# EAGLE design safebox_professional (EAGLE 9.6.2)
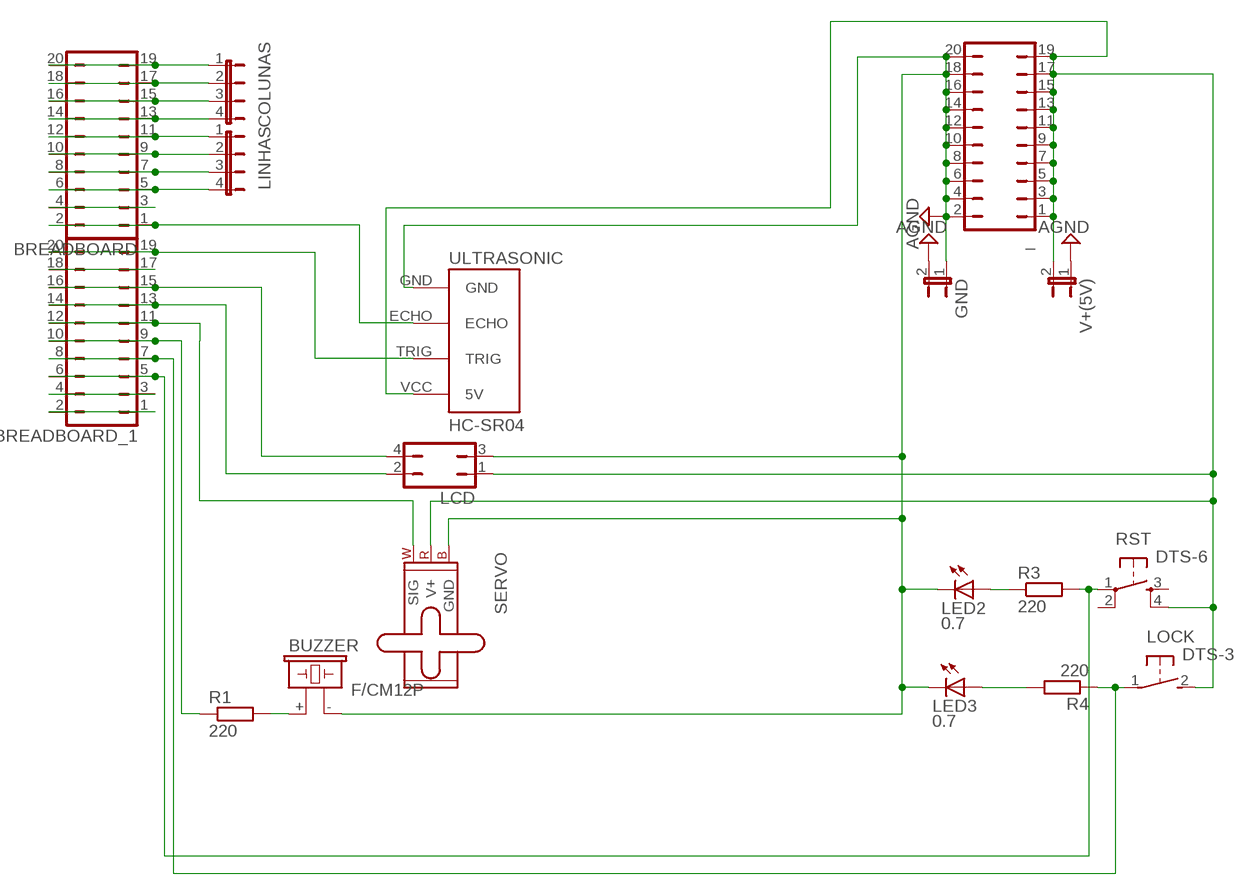
[diagram p0: schematic, sheet 1]

## Parts
_  JP10Q  [JP10Q]
BREADBOARD  JP10Q  [JP10Q]
BREADBOARD_1  JP10Q  [JP10Q]
BUZZER  F/CM12P  [F/CM12P]
COLUNAS  JP4E  [JP4]
GND  JP1E  [JP1]
LCD  JP2Q  [JP2Q]
LED2  0.7  LED5MM  [LED5MM]
LED3  0.7  LED5MM  [LED5MM]
LINHAS  JP4E  [JP4]
LOCK  DTS-3  [DTS-3]
M2  SERVO  [1X03]
R1  220  R-EU_0207/12  [0207/12]
R3  220  R-EU_0207/12  [0207/12]
R4  220  R-EU_0207/12  [0207/12]
RST  DTS-6  [DTS-6]
ULTRASONIC  HC-SR04  [HC-SR04_FOOTPRINT]
V+(5V)  JP1E  [JP1]

## Nets
AGND: _.2 _.4 _.6 _.8 _.10 _.12 _.14 _.16 _.18 _.20 BUZZER.- GND.1 GND.2 LCD.3 LED2.K(C) LED3.K(C) M2.3(GND) ULTRASONIC.GND V+(5V).1
N$1: BREADBOARD_1.5 BREADBOARD_1.6 R3.2 RST.1
N$2: BREADBOARD_1.1 BREADBOARD_1.2
N$3: BREADBOARD.19 BREADBOARD.20 COLUNAS.1
N$4: BREADBOARD.17 BREADBOARD.18 COLUNAS.2
N$5: BREADBOARD.15 BREADBOARD.16 COLUNAS.3
N$6: BREADBOARD.13 BREADBOARD.14 COLUNAS.4
N$7: BREADBOARD.11 BREADBOARD.12 LINHAS.1
N$8: BREADBOARD.9 BREADBOARD.10 LINHAS.2
N$9: BREADBOARD.7 BREADBOARD.8 LINHAS.3
N$10: BREADBOARD.5 BREADBOARD.6 LINHAS.4
N$11: LED2.A R3.1
N$12: BUZZER.+ R1.2
N$13: BREADBOARD.1 BREADBOARD.2 ULTRASONIC.ECHO
N$14: BREADBOARD_1.15 BREADBOARD_1.16 LCD.4
N$15: BREADBOARD_1.13 BREADBOARD_1.14 LCD.2
N$16: BREADBOARD_1.17 BREADBOARD_1.18
N$17: BREADBOARD_1.9 BREADBOARD_1.10 R1.1
N$18: BREADBOARD_1.7 BREADBOARD_1.8 LOCK.1 R4.1
N$19: BREADBOARD_1.11 BREADBOARD_1.12 M2.1(SIG)
N$20: BREADBOARD.3 BREADBOARD.4
N$21: BREADBOARD_1.19 BREADBOARD_1.20 ULTRASONIC.TRIG
N$23: BREADBOARD_1.3 BREADBOARD_1.4
N$24: LED3.A R4.2
N$26: _.1 _.3 _.5 _.7 _.9 _.11 _.13 _.15 _.17 _.19 LCD.1 LOCK.2 M2.2(V+) RST.4 ULTRASONIC.VCC(5V) V+(5V).2
Unconnected: RST.2 RST.3

## Library data of the parts
_ BREADBOARD BREADBOARD_1 = jumper:JP10Q: JUMPER
BUZZER = buzzer:F/CM12P: BUZZER Source: Buerklin; OC_FARNELL: unknown; OC_NEWARK: unknown
COLUNAS LINHAS = jumper:JP4E: JUMPER
GND V+(5V) = jumper:JP1E: JUMPER
LCD = jumper:JP2Q: JUMPER
LED2 LED3 = adafruit:LED: LED OSRAM: - CHIPLED LG R971, LG N971, LY N971, LG Q971, LY Q971, LO R971, LY R971 LH N974, LH R974 LS Q976, LO Q976, LY Q976 LO Q996 - Hyper CHIPLED LW Q18S LB Q993, LB Q99A, LB R99A - SideLED LS A670, LO A670, LY A670, LG A670, LP A670 LB A673, LV A673, LT A673, LW A673 LH A674 LY A675 LS A676, LA A676, LO A676, LY A676, LW A676 LS A679, LY A679, LG A679 - Hyper Micro SIDELED® LS Y876, LA Y876, LO Y876, LY Y876 LT Y87S - SmartLED LW L88C, LW L88S LB L89C, LB L89S, LG L890 LS L89K, LO L89K, LY L89K LS L896, LA L896, LO L896, LY L896 - TOPLED LS T670, LO T670, LY T670, LG T670, LP T670 LSG T670, LSP T670, LSY T670, LOP T670, LYG T670 LG T671, LOG T671, LSG T671 LB T673, LV T673, LT T673, LW T673 LH T674 LS T676, LA T676, LO T676, LY T676, LB T676, LH T676, LSB T676, LW T676 LB T67C, LV T67C, LT T67C, LS T67K, LO T67K, LY T67K, LW E67C LS E67B, LA E67B, LO E67B, LY E67B, LB E67C, LV E67C, LT E67C LW T67C LS T679, LY T679, LG T679 LS T770, LO T770, LY T770, LG T770, LP T770 LB T773, LV T773, LT T773, LW T773 LH T774 LS E675, LA E675, LY E675, LS T675 LS T776, LA T776, LO T776, LY T776, LB T776 LHGB T686 LT T68C, LB T68C - Hyper Mini TOPLED® LB M676 - Mini TOPLED Santana® LG M470 LS M47K, LO M47K, LY M47K Source: http://www.osram.convergy.de/
LOCK = switch-tact:DTS-3
M2 = SparkFun-Electromechanical:SERVO: Servo Motor 3-pin connector for a standard servo motor (voltage supply, ground, and control signal.) SparkFun Products Servo - Generic (Sub-Micro Size) <https://www.sparkfun.com/products/9065> (ROB-09065) Servo - Generic High Torque Continuous Rotation (Standard Size) <https://www.sparkfun.com/products/9347> (ROB-09347) Servo - Generic High Torque (Standard Size) <https://www.sparkfun.com/products/11965> (ROB-11965)
R1 R3 R4 = rcl:R-EU_: RESISTOR, European symbol; SPICEPREFIX: R
RST = switch-tact:DTS-6
ULTRASONIC = Ultrasonic Sensor HC-SR04:HC-SR04: Ultrasonic Sensor HC-SR04

## Board
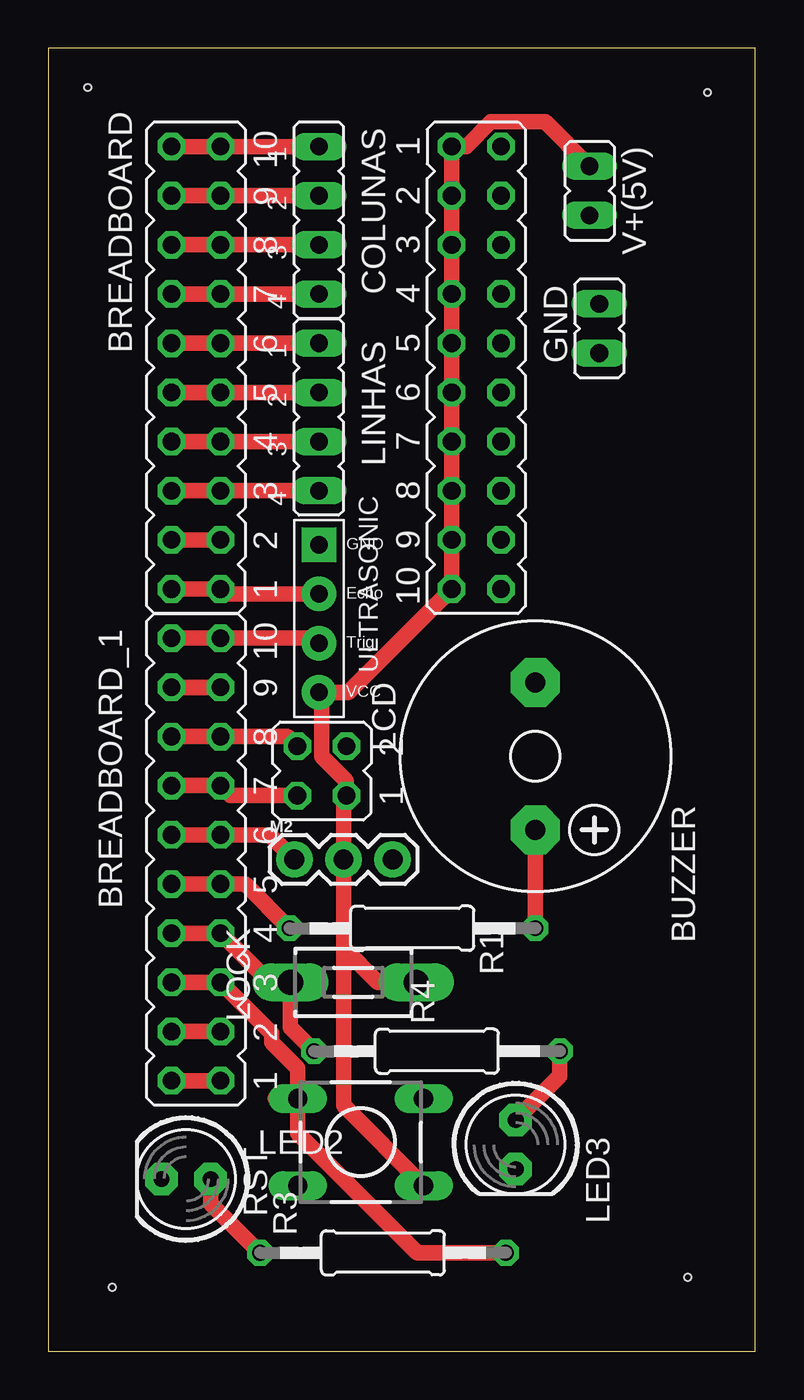
[diagram p1: board, top side]
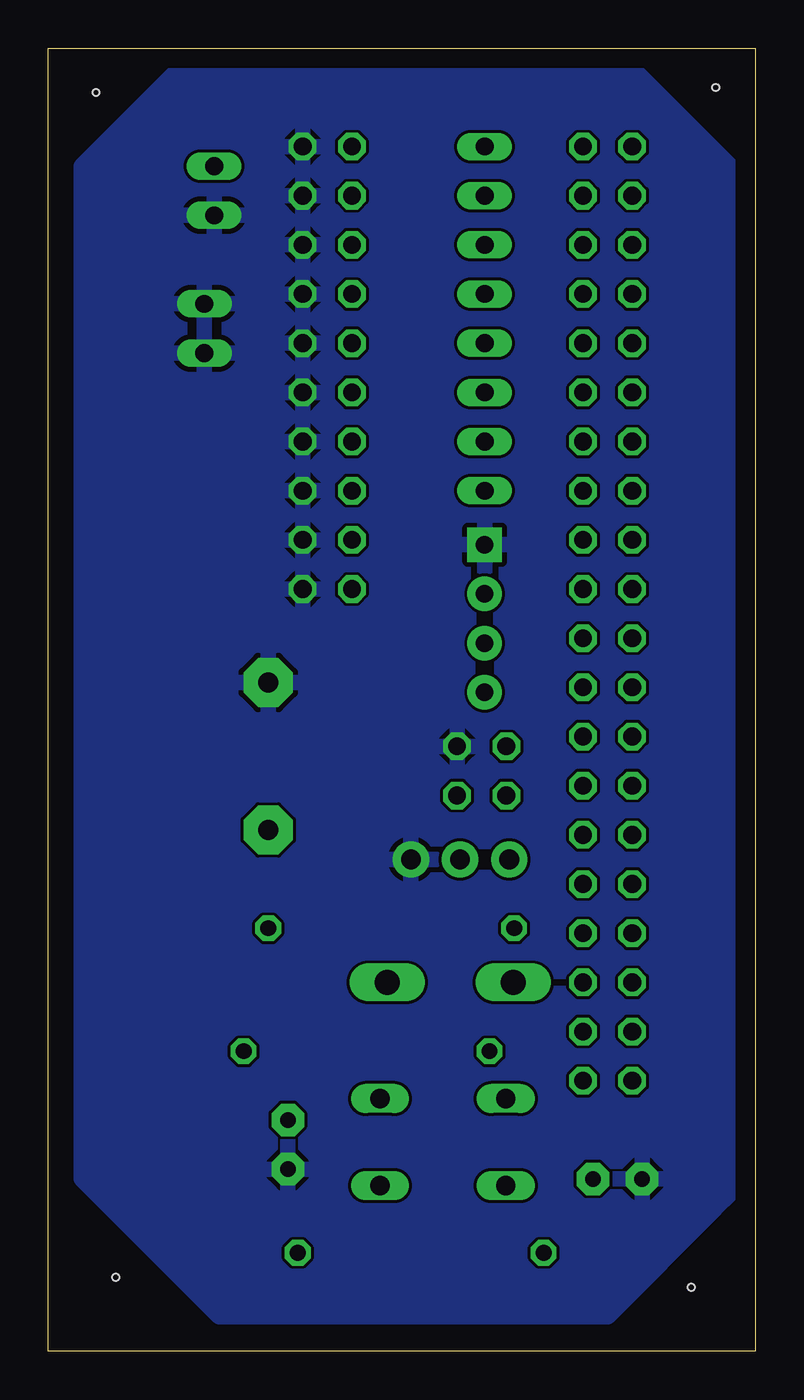
[diagram p2: board, bottom side, seen from below]

Size 36.5 x 67.3 mm. Coordinates in mm from the lower left corner, seen from the top.
Outline: 0,0 36.5,0 36.5,67.3 0,67.3 0,0
Copper layers (1*16): Top 0.035mm / dielectric 1.5mm / Bottom 0.035mm
Design rules "default": minimum track width 6mil, minimum drill 0.35mm, track to track 6mil, track to pad 6mil, pad to pad 6mil, via to via 6mil, smd to smd 6mil, copper to edge 40mil, drill to drill 6mil, minimum pad ring 10mil, minimum via ring 8mil, stop-mask expansion 4mil, vias tented up to drill 0mil, thermal gap 10mil
Holes 0.35 mm at 2.03,65.28 34.04,65.02 33.02,3.81 3.3,3.3

### Footprints (pad centres in the part's own frame; a part is rotated, then mirrored left to right if it is on the bottom)
JP10Q = drill 0.914 octagon: 1 -11.43,-1.27; 2 -11.43,1.27; 3 -8.89,-1.27; 4 -8.89,1.27; 5 -6.35,-1.27; 6 -6.35,1.27; 7 -3.81,-1.27; 8 -3.81,1.27; 9 -1.27,-1.27; 10 -1.27,1.27; 11 1.27,-1.27; 12 1.27,1.27; 13 3.81,-1.27; 14 3.81,1.27; 15 6.35,-1.27; 16 6.35,1.27; 17 8.89,-1.27; 18 8.89,1.27; 19 11.43,-1.27; 20 11.43,1.27
F/CM12P = drill 1.016 pad 2.54 octagon: + 3.81,0; - -3.81,0
JP4 = drill 0.914 long: 1 -3.81,0; 2 -1.27,0; 3 1.27,0; 4 3.81,0
JP1 = drill 0.914 long: 1 0,-1.27; 2 0,1.27
JP2Q = drill 0.914 octagon: 1 -1.27,-1.27; 2 -1.27,1.27; 3 1.27,-1.27; 4 1.27,1.27
LED5MM = drill 0.813 pad 1.676 octagon: A -1.27,0; K 1.27,0
DTS-3 = drill 1.3 long: 1 -3.25,0; 2 3.25,0
1X03 = drill 1.016 pad 1.88: 1 0,0; 2 2.54,0; 3 5.08,0
0207/12 = drill 0.813 octagon: 1 -6.35,0; 2 6.35,0
DTS-6 = drill 1 long: 1 -3.25,2.25; 2 3.25,2.25; 3 -3.25,-2.25; 4 3.25,-2.25
HC-SR04_FOOTPRINT = drill 0.9 pad 1.778: ECHO 0,1.27; TRIG 0,-1.27; VCC 0,-3.81 | drill 0.9 pad 1.778 square: GND 0,3.81

### Placement (x,y rotation side)
_  22.1,50.8 270 top
BREADBOARD  7.62,50.8 90 top
BREADBOARD_1  7.62,25.4 90 top
BUZZER  25.15,30.73 270 top
COLUNAS  13.97,58.42 270 top
GND  28.45,52.83 0 top
LCD  14.12,29.97 90 top
LED2  7.11,8.89 180 top
LED3  24.13,10.67 270 top
LINHAS  13.97,48.26 270 top
LOCK  15.75,19.05 0 top
M2  12.7,25.4 0 top
R1  18.8,21.84 0 top
R3  17.27,5.08 0 top
R4  20.07,15.49 0 top
RST  16.13,10.8 0 top
ULTRASONIC  13.97,37.85 0 top
V+(5V)  27.94,59.94 0 top

### Tracks (layer width: path | path; a pad name or v marks a point on that pad's centre or on a via)
AGND
  pour Bottom: 6.6,66.55 1.27,61.21 1.27,60.2 1.27,8.13 2.03,7.37 7.62,1.78 7.87,1.78 27.69,1.78 34.8,8.89 34.8,61.21 29.46,66.55
N$1
  Top 0.813: BREADBOARD_1.6 BREADBOARD_1.5 11.53,16.41 11.53,15.95 12.88,14.61 RST.1 | 11.72,13.05 RST.1 | R3.2 19.05,5.08 12.88,11.25 RST.1
N$2
  Top 0.813: BREADBOARD_1.2 BREADBOARD_1.1
N$3
  Top 0.813: COLUNAS.1 BREADBOARD.19 BREADBOARD.20
N$4
  Top 0.813: COLUNAS.2 BREADBOARD.17 BREADBOARD.18
N$5
  Top 0.813: COLUNAS.3 BREADBOARD.15 BREADBOARD.16
N$6
  Top 0.813: COLUNAS.4 BREADBOARD.13 BREADBOARD.14
N$7
  Top 0.813: LINHAS.1 BREADBOARD.11 BREADBOARD.12
N$8
  Top 0.813: LINHAS.2 BREADBOARD.9 BREADBOARD.10
N$9
  Top 0.813: LINHAS.3 BREADBOARD.7 BREADBOARD.8
N$10
  Top 0.813: LINHAS.4 BREADBOARD.5 BREADBOARD.6
N$11
  Top 0.813: R3.1 8.38,7.62 LED2.A
N$12
  Top 0.813: R1.2 BUZZER.+
N$13
  Top 0.813: ULTRASONIC.ECHO 9.14,39.12 BREADBOARD.1 BREADBOARD.2
N$14
  Top 0.813: BREADBOARD_1.16 BREADBOARD_1.15 12.34,31.75 LCD.4
N$15
  Top 0.813: BREADBOARD_1.14 BREADBOARD_1.13 9.4,28.7 LCD.2
N$16
  Top 0.813: BREADBOARD_1.18 BREADBOARD_1.17
N$17
  Top 0.813: BREADBOARD_1.10 BREADBOARD_1.9 10.16,24.13 R1.1
N$18
  Top 0.813: BREADBOARD_1.8 BREADBOARD_1.7 11.43,19.05 LOCK.1 | LOCK.1 | LOCK.1 12.5,16.71 R4.1
N$19
  Top 0.813: BREADBOARD_1.12 BREADBOARD_1.11 11.43,26.67 M2.1
N$20
  Top 0.813: BREADBOARD.3 BREADBOARD.4
N$21
  Top 0.813: ULTRASONIC.TRIG 13.72,36.83 BREADBOARD_1.19 BREADBOARD_1.20
N$23
  Top 0.813: BREADBOARD_1.4 BREADBOARD_1.3
N$24
  Top 0.813: R4.2 26.42,14.22 LED3.A
N$26
  Top 0.813: RST.4 15.24,12.68 15.24,20.83 | 15.24,20.83 M2.2 15.24,28.55 LCD.1 15.39,29.45 14.12,30.72 14.12,33.88 ULTRASONIC.VCC 15.49,34.04 _.19 _.17 _.15 _.13 _.11 _.9 _.7 _.5 _.3 _.1 21.57,62.23 22.84,63.5 25.65,63.5 V+(5V).2 | LOCK.2 17.02,19.05 15.24,20.83